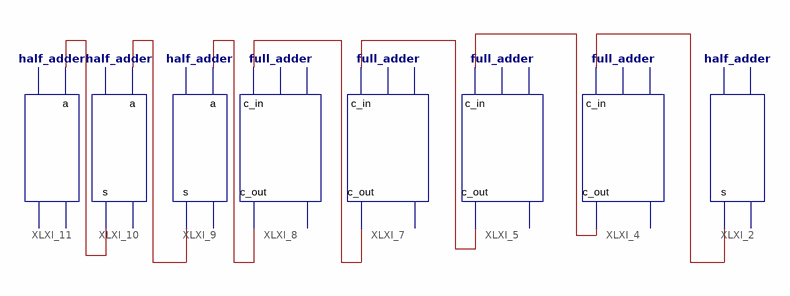
[diagram p0: schematic sheet 1]
// Xilinx ISE schematic adder_8_5_bit.sch (spartan6) as structural Verilog: 8 symbols, 0 ports
module adder_8_5_bit (
);

  wire XLXN_1, XLXN_2, XLXN_10, XLXN_23, XLXN_25, XLXN_26, XLXN_27;

  half_adder XLXI_2 (.s(XLXN_1));  // open: a, b, c_out
  full_adder XLXI_4 (.c_in(XLXN_1), .c_out(XLXN_2));  // open: a, b, s
  full_adder XLXI_5 (.c_in(XLXN_2), .c_out(XLXN_10));  // open: a, b, s
  full_adder XLXI_7 (.c_in(XLXN_10), .c_out(XLXN_27));  // open: a, b, s
  full_adder XLXI_8 (.c_in(XLXN_27), .c_out(XLXN_23));  // open: a, b, s
  half_adder XLXI_9 (.a(XLXN_23), .s(XLXN_25));  // open: b, c_out
  half_adder XLXI_10 (.a(XLXN_25), .s(XLXN_26));  // open: b, c_out
  half_adder XLXI_11 (.a(XLXN_26));  // open: b, c_out, s
endmodule
